# EAGLE design kaya-insolev1 (EAGLE 9.1.0)
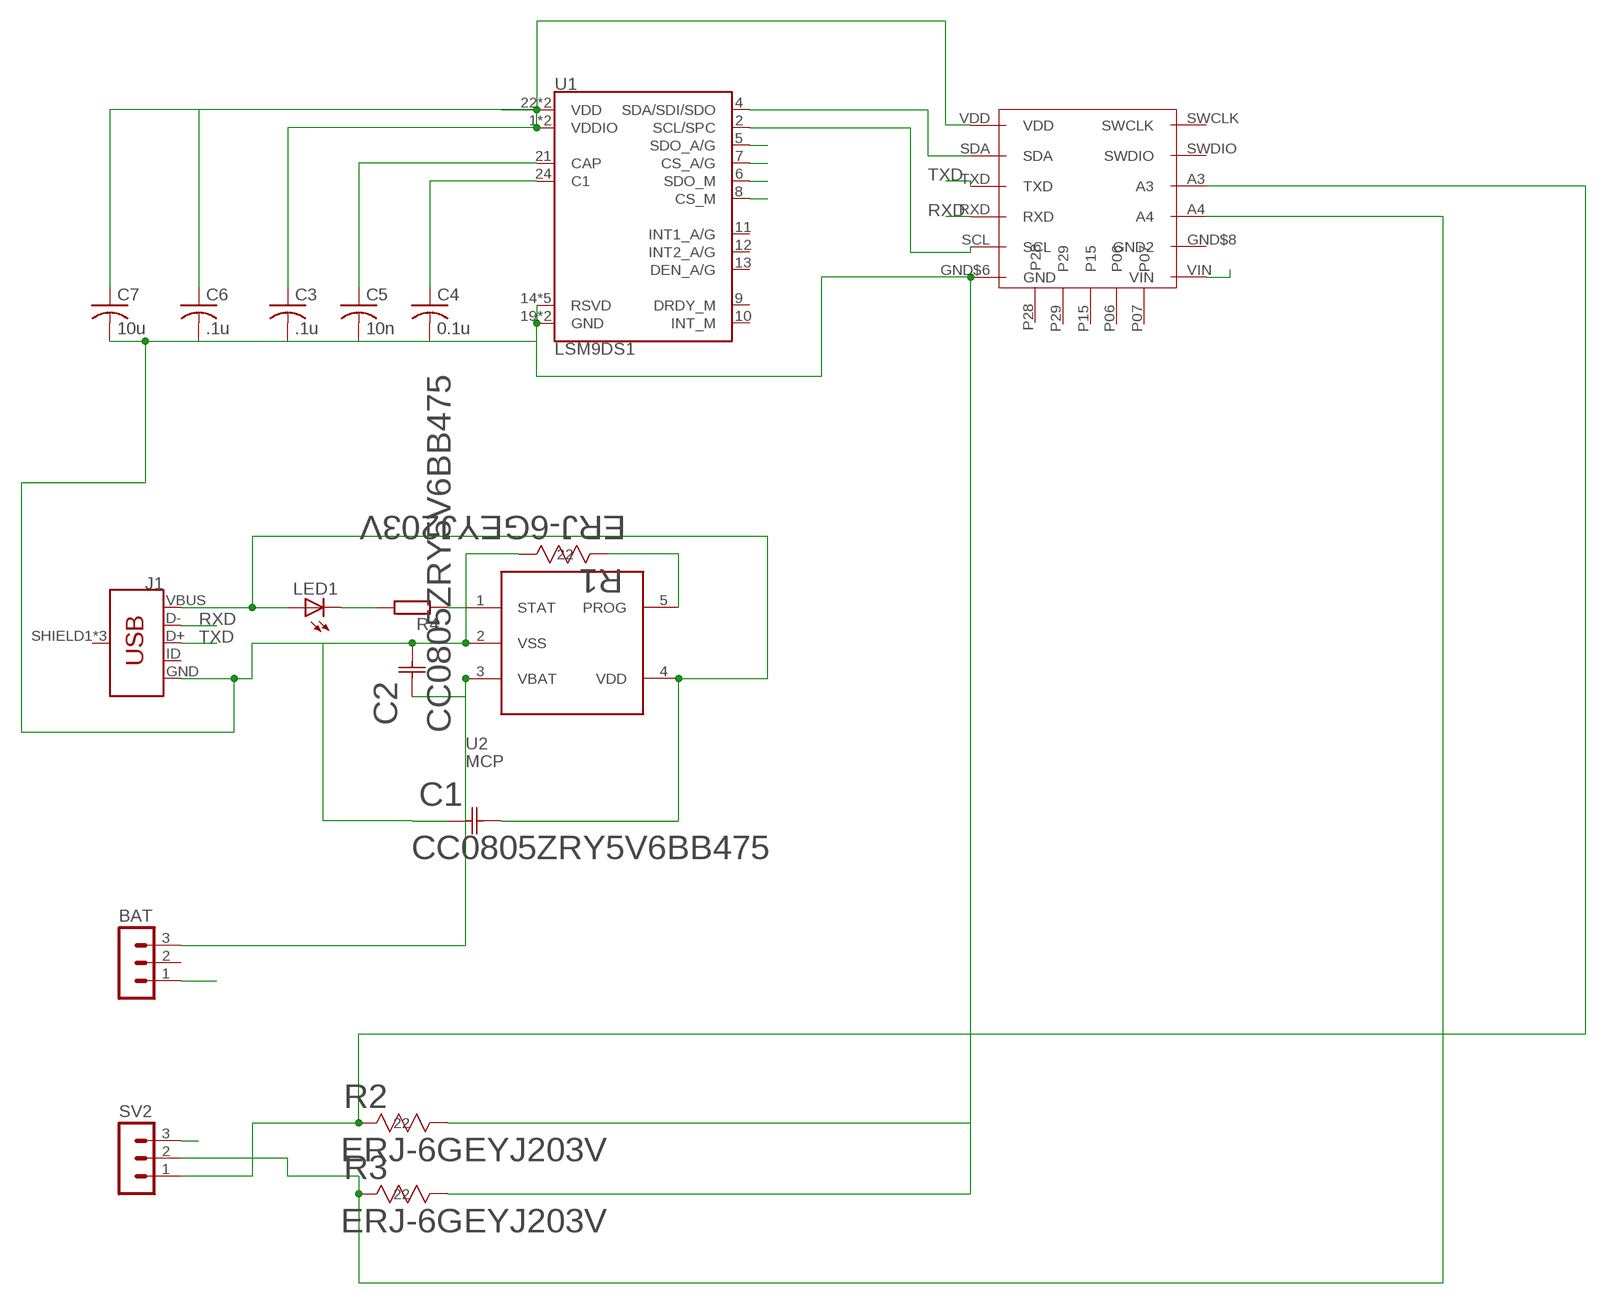
[diagram p0: schematic, sheet 1]

## Parts
BAT  MA03-1  [MA03-1]
C1  CC0805ZRY5V6BB475  [YAG_CC0805]
C2  CC0805ZRY5V6BB475  [YAG_CC0805]
C3  .1u  C-USC0603  [C0603]
C4  0.1u  C-USC0603  [C0603]
C5  10n  C-USC0603  [C0603]
C6  .1u  C-USC0603  [C0603]
C7  10u  C-USC0603  [C0603]
J1  USB_MICRO-B_FEMALE-SMT  [USB-B-MICRO-SMD]
LED1  LEDCHIPLED_0603  [CHIPLED_0603]
R1  ERJ-6GEYJ203V  [RC0805N]
R2  ERJ-6GEYJ203V  [RC0805N]
R3  ERJ-6GEYJ203V  [RC0805N]
R4  R-EU_R0603  [R0603]
SV2  MA03-1  [MA03-1]
U1  LSM9DS1  [LGA-24-3.5X3]
U2  MCP  MCP73832T-2ACI/OT  [SOT23-5]
U$1  BLE-NANO  [BLE-NANO-PKG]

## Nets
GND [GND]: C1.1 C2.2 C3.2 C4.2 C5.2 C6.2 C7.2 J1.GND R1.1 R2.1 R3.1 U1.14(RSVD) U1.15(RSVD) U1.16(RSVD) U1.17(RSVD) U1.18(RSVD) U1.19(GND) U1.20(GND) U2.2(VSS) U$1.GND$6(GND)
N$3: U1.4(SDA/SDI/SDO) U$1.SDA
N$4: U1.2(SCL/SPC) U$1.SCL
N$5: C4.1 U1.24(C1)
N$6: C5.1 U1.21(CAP)
N$8: LED1.C R4.2
N$9: R4.1 U2.1(STAT)
N$12: BAT.3 C2.1 U2.3(VBAT)
N$13: R2.2 SV2.1 U$1.A3
N$14: R3.2 SV2.2 U$1.A4
N$16: R1.2 U2.5(PROG)
RXD: J1.D- U$1.RXD
TXD: J1.D+ U$1.TXD
VBUS: C1.2 J1.VBUS LED1.A U2.4(VDD)
VDD: C3.1 C6.1 C7.1 SV2.3 U1.1(VDDIO) U1.3(VDDIO) U1.5(SDO_A/G) U1.6(SDO_M) U1.7(CS_A/G) U1.8(CS_M) U1.22(VDD) U1.23(VDD) U$1.VDD
VIN: BAT.1 U$1.VIN
Unconnected: BAT.2 J1.ID J1.SHIELD1(SHIELD) J1.SHIELD2(SHIELD) J1.SHIELD3(SHIELD) U1.9(DRDY_M) U1.10(INT_M) U1.11(INT1_A/G) U1.12(INT2_A/G) U1.13(DEN_A/G) U$1.GND$8(GND2) U$1.P06 U$1.P07 U$1.P15 U$1.P28 U$1.P29 U$1.SWCLK U$1.SWDIO

## Library data of the parts
BAT SV2 = con-lstb:MA03-1: PIN HEADER; OC_FARNELL: unknown; OC_NEWARK: unknown
C1 C2 = Yageo 4.7uF Cap:CC0805ZRY5V6BB475; MANUFACTURER_PART_NUMBER: CC0805ZRY5V6BB475; VENDOR: Yageo
C3-C7 = rcl:C-US: CAPACITOR, American symbol; SPICEPREFIX: C
J1 = SparkFun-Connectors:USB_MICRO-B: USB Type Micro-B Connector Male/female and PTH/SMT variants SparkFun Products: SparkFun microB USB Breakout <https://www.sparkfun.com/products/12035> SparkFun USB microB Plug Breakout <https://www.sparkfun.com/products/10031> SparkFun ESP8266 Thing <https://www.sparkfun.com/products/13231>; PROD_ID: CONN-11752
LED1 = led:LED: LED OSRAM: - CHIPLED LG R971, LG N971, LY N971, LG Q971, LY Q971, LO R971, LY R971 LH N974, LH R974 LS Q976, LO Q976, LY Q976 LO Q996 - Hyper CHIPLED LW Q18S LB Q993, LB Q99A, LB R99A - SideLED LS A670, LO A670, LY A670, LG A670, LP A670 LB A673, LV A673, LT A673, LW A673 LH A674 LY A675 LS A676, LA A676, LO A676, LY A676, LW A676 LS A679, LY A679, LG A679 - Hyper Micro SIDELED® LS Y876, LA Y876, LO Y876, LY Y876 LT Y87S - SmartLED LW L88C, LW L88S LB L89C, LB L89S, LG L890 LS L89K, LO L89K, LY L89K LS L896, LA L896, LO L896, LY L896 - TOPLED LS T670, LO T670, LY T670, LG T670, LP T670 LSG T670, LSP T670, LSY T670, LOP T670, LYG T670 LG T671, LOG T671, LSG T671 LB T673, LV T673, LT T673, LW T673 LH T674 LS T676, LA T676, LO T676, LY T676, LB T676, LH T676, LSB T676, LW T676 LB T67C, LV T67C, LT T67C, LS T67K, LO T67K, LY T67K, LW E67C LS E67B, LA E67B, LO E67B, LY E67B, LB E67C, LV E67C, LT E67C LW T67C LS T679, LY T679, LG T679 LS T770, LO T770, LY T770, LG T770, LP T770 LB T773, LV T773, LT T773, LW T773 LH T774 LS E675, LA E675, LY E675, LS T675 LS T776, LA T776, LO T776, LY T776, LB T776 LHGB T686 LT T68C, LB T68C - Hyper Mini TOPLED® LB M676 - Mini TOPLED Santana® LG M470 LS M47K, LO M47K, LY M47K Source: http://www.osram.convergy.de LUXEON: - LUMILED® LXK2-PW12-R00, LXK2-PW12-S00, LXK2-PW14-U00, LXK2-PW14-V00 LXK2-PM12-R00, LXK2-PM12-S00, LXK2-PM14-U00 LXK2-PE12-Q00, LXK2-PE12-R00, LXK2-PE12-S00, LXK2-PE14-T00, LXK2-PE14-U00 LXK2-PB12-K00, LXK2-PB12-L00, LXK2-PB12-M00, LXK2-PB14-N00, LXK2-PB14-P00, LXK2-PB14-Q00 LXK2-PR12-L00, LXK2-PR12-M00, LXK2-PR14-Q00, LXK2-PR14-R00 LXK2-PD12-Q00, LXK2-PD12-R00, LXK2-PD12-S00 LXK2-PH12-R00, LXK2-PH12-S00 LXK2-PL12-P00, LXK2-PL12-Q00, LXK2-PL12-R00 Source: www.luxeon.com KINGBRIGHT: KA-3528ASYC Source: www.kingbright.com
R1-R3 = Panasonic 20K Res:ERJ-6GEYJ203V; MANUFACTURER_PART_NUMBER: ERJ6GEYJ203V; VENDOR: Panasonic
R4 = rcl:R-EU_: RESISTOR, European symbol; SPICEPREFIX: R
U1 = SparkFun-Sensors:LSM9DS1: ST Microelectronics LSM9DS1 9DOF IMU - Accelerometer, Gyroscope & Magnetometer The LSM9DS1 is a versatile, motion-sensing system-in-a-chip. It houses a 3-axis accelerometer, 3-axis gyroscope, and 3-axis magnetometer – nine degrees of freedom (9DOF) in a single IC! The LSM9DS1 is equipped with a digital interface, but even that is flexible: it supports both I2C and SPI, so you’ll be hard-pressed to find a microcontroller it doesn’t work with. Datasheet <https://cdn.sparkfun.com/assets/learn_tutorials/3/7/3/LSM9DS1_Datasheet.pdf> SparkFun Products SparkFun 9 Degrees of Freedom IMU Breakout - LSM9DS1 <https://www.sparkfun.com/products/13284> (SEN-13284) SparkFun Photon IMU Shield <https://www.sparkfun.com/products/13629> (DEV-13629); PROD_ID: IC-12536
U2 = MCP73832T-2ACI_OT:MCP73832T-2ACI/OT: http://octopart.com/mcp73832t-2aci%2Fot-microchip-664172; AVAILABILITY: Unavailable; MF: Microchip; MP: MCP73832T-2ACI-OT; PACKAGE: SOT-23-5 Microchip; PRICE: None
U$1 = BLE-NANO:BLE-NANO

## Net classes
0 signal: width 0.127 mm
1 VDD: width 0.254 mm
2 GND: width 0.254 mm

## Board
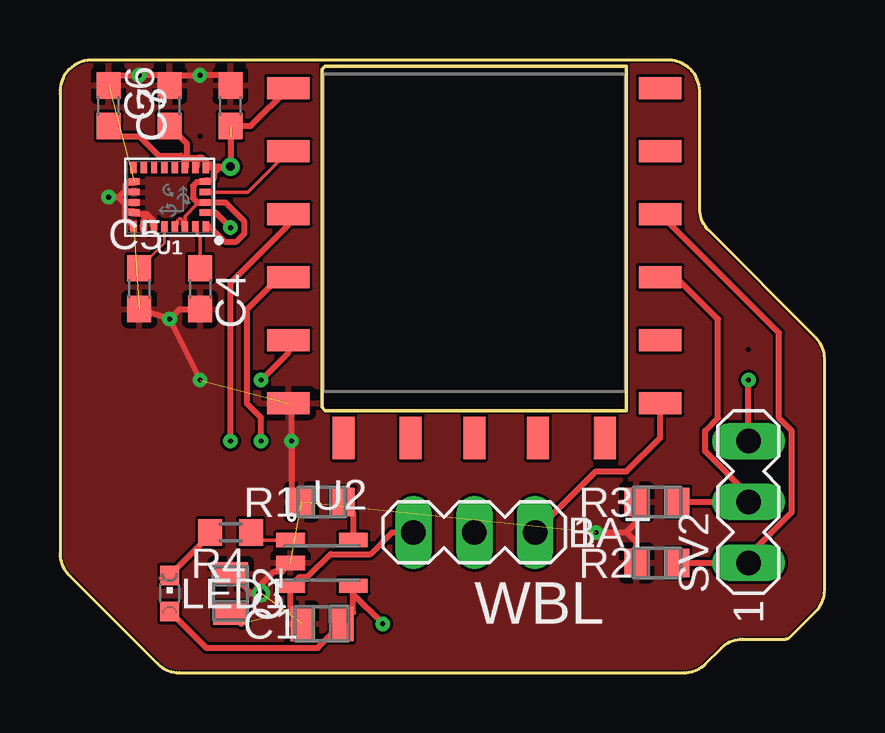
[diagram p1: board, top side]
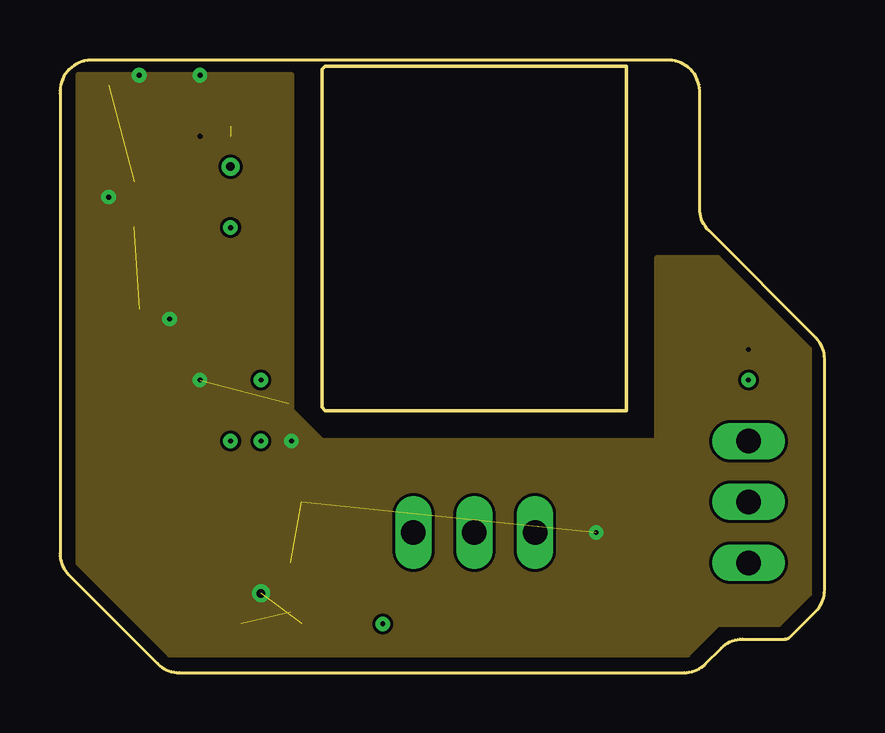
[diagram p2: board, inner layer GND]
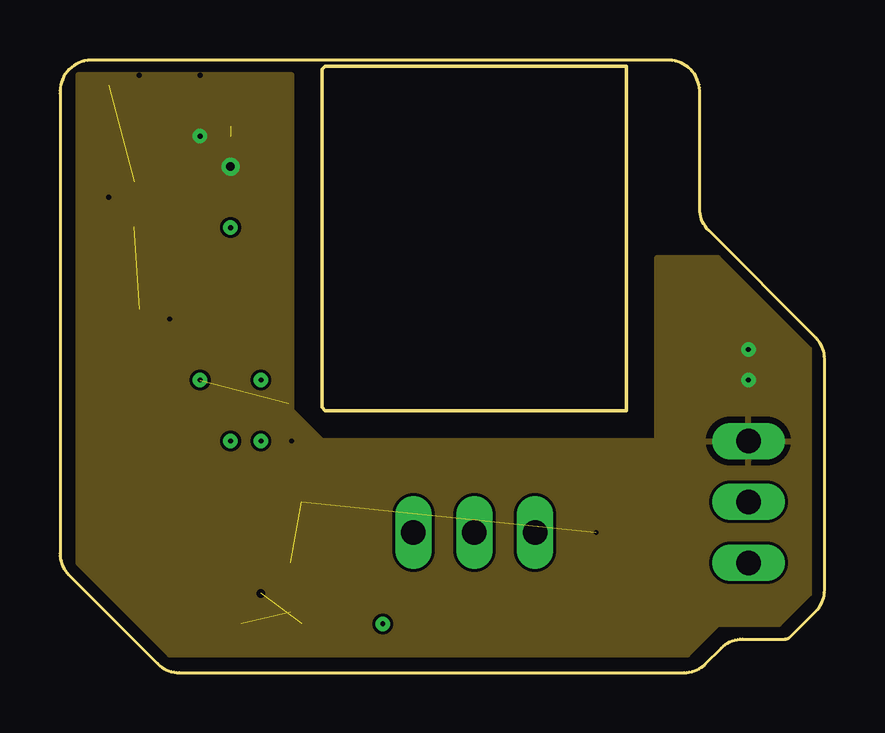
[diagram p3: board, inner layer VDD]
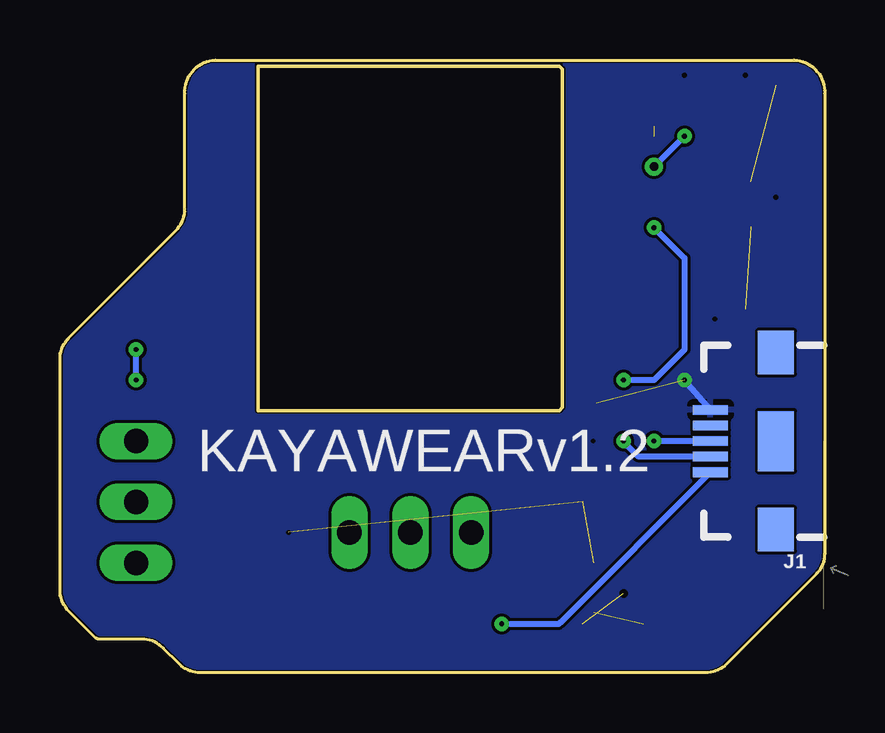
[diagram p4: board, bottom side, seen from below]

Size 31.88 x 25.53 mm. Coordinates in mm from the lower left corner, seen from the top.
Outline: 0,24.13 0,4.97 arc45 0.37,4.07 4.07,0.37 arc45 4.97,0 26.02,0 arc45 26.92,0.37 27.57,1.03 arc-45 28.47,1.4 30.23,1.4 arc45 30.44,1.49 31.51,2.55 arc45 31.88,3.45 31.88,13.06 arc45 31.51,13.96 27.04,18.42 arc-45 26.67,19.32 26.67,24.13 arc90 25.4,25.53 1.27,25.53 arc90 0,24.13
Outline: 10.92,25.02 10.92,11.05 11.05,10.92 23.62,10.92 23.62,25.02 23.62,25.27 11.05,25.27 10.92,25.15 10.92,25.02
Copper layers ((1*2)+(15*16)): SIGNAL 0.035mm / dielectric 0.2mm / GND 0.035mm / dielectric 0.15mm / VDD 0.035mm / dielectric 0.2mm / Bottom 0.035mm
Design rules "default *": minimum track width 5mil, minimum drill 0.2mm, track to track 5mil, track to pad 5mil, pad to pad 5mil, via to via 5mil, smd to smd 5mil, copper to edge 2mil, drill to drill 8mil, minimum pad ring 10mil, minimum via ring 8mil, stop-mask expansion 4mil, vias tented up to drill 0mil, thermal gap 10mil
tRestrict: area 10.9,11 to 23.7,25.3
bRestrict: area 10.9,10.9 to 23.7,25.3

### Footprints (pad centres in the part's own frame; a part is rotated, then mirrored left to right if it is on the bottom)
MA03-1 = drill 1.016 long: 1 -2.54,0; 2 0,0; 3 2.54,0
YAG_CC0805 = smd 0.965 x 1.448: 1 -0.826,0; 2 0.826,0
C0603 = smd 1.1 x 1: 1 -0.85,0; 2 0.85,0
USB-B-MICRO-SMD = smd 1.45 x 0.4: D+ 2.725,0; D- 2.725,0.65; GND 2.725,-1.3; ID 2.725,-0.65; VBUS 2.725,1.3 | smd 1.5 x 1.8: SHIELD1 0,3.685; SHIELD2 0,-3.685 | smd 1.5 x 2.5: SHIELD3 0,0
CHIPLED_0603 = smd 0.8 x 0.8: A 0,-0.75; C 0,0.75
RC0805N = smd 1.006 x 1.2: 1 -0.853,0; 2 0.853,0
R0603 = smd 1 x 1.1: 1 -0.85,0; 2 0.85,0
LGA-24-3.5X3 = smd 0.27 x 0.45: 1 -1.505,1.225; 6 -1.505,-1.225; 7 -1.075,-1.225; 8 -0.645,-1.225; 9 -0.215,-1.225; 10 0.215,-1.225; 11 0.645,-1.225; 12 1.075,-1.225; 13 1.505,-1.225; 18 1.505,1.225; 19 1.075,1.225; 20 0.645,1.225; 21 0.215,1.225; 22 -0.215,1.225; 23 -0.645,1.225; 24 -1.075,1.225 | smd 0.45 x 0.27: 2 -1.475,0.645; 3 -1.475,0.215; 4 -1.475,-0.215; 5 -1.475,-0.645; 14 1.475,-0.645; 15 1.475,-0.215; 16 1.475,0.215; 17 1.475,0.645
SOT23-5 = smd 1.2 x 0.6: 1 -1.306,0.95; 2 -1.306,0; 3 -1.306,-0.95; 4 1.306,-0.95; 5 1.306,0.95
BLE-NANO-PKG = smd 1.778 x 0.914: A3 7.75,4.375; A4 7.75,1.75; GND$6 -7.75,-3.5; GND$8 7.75,-0.875; RXD -7.75,1.75; SCL -7.75,-0.875; SDA -7.75,7; SWCLK 7.75,9.625; SWDIO 7.75,7; TXD -7.75,4.375; VDD -7.75,9.625; VIN 7.75,-3.5 | smd 0.914 x 1.778: P06 2.65,-4.95; P07 5.45,-4.95; P15 0,-4.95; P28 -5.45,-4.95; P29 -2.65,-4.95

### Placement (x,y rotation side)
BAT  17.27,5.84 180 top
C1  10.92,2.03 0 top
C2  7.11,3.3 90 top
C3  2.03,23.62 90 top
C4  5.84,16 270 top
C5  3.3,16 270 top
C6  4.57,23.62 90 top
C7  7.11,23.62 90 top
J1  2.03,9.65 180 bottom
LED1  4.57,3.3 0 top
R1  10.92,7.11 0 top
R2  24.89,4.57 0 top
R3  24.89,7.11 0 top
R4  7.11,5.84 180 top
SV2  28.7,7.11 90 top
U1  4.57,19.81 180 top
U2  10.92,4.57 0 top
U$1  17.27,14.73 0 top

### Tracks (layer width: path | path; a pad name or v marks a point on that pad's centre or on a via)
GND  (via drill 0.2, 0.2 layers 1-2, 0.35 layers 1-2)  (6 unrouted)
  SIGNAL 0.254: v4.57,14.73 C5.2 | v4.57,14.73 4.99,15.15 C4.2 | C3.2 2.45,24.89 v3.3,24.89 4.15,24.89 C6.2 4.99,24.89 v5.84,24.89 6.69,24.89 C7.2 | 2.45,19.81 v2.03,19.81 | U1.14 3.03,20.39 2.81,20.39 2.72,20.3 2.72,20.08 2.45,19.81 | U1.15 2.67,20.03 2.45,19.81 | U1.16 2.67,19.6 2.45,19.81 | 2.72,19.32 2.81,19.23 3.03,19.23 U1.17 3.16,19.1 | 2.45,19.81 2.72,19.54 2.72,19.32 | U1.18 2.85,18.8 2.81,18.8 2.72,18.89 2.72,19.32 | 3.44,19.1 3.52,19.02 3.52,18.89 3.5,18.86 U1.19 | 3.44,19.1 3.16,19.1 | U1.20 3.86,18.65 3.86,18.88 3.64,19.1 3.44,19.1 | 3.44,19.1 3.16,19.1 | v4.57,14.73 v5.84,12.19 | U$1.GND$6 9.65,11.1 v9.65,9.65 9.65,7.53 R1.1 | U2.2 9.25,4.2 8.9,4.2 8.38,3.68 v8.38,3.3 7.94,3.3 C2.2 | v22.35,5.84 23.62,5.84 | 23.62,5.84 24.04,6.26 R3.1 | R2.1 24.04,5.43 23.62,5.84
  Bottom 0.254: J1.GND v5.84,12.19
  pour GND: 0.76,9.65 0.76,4.57 4.57,0.76 26.16,0.76 27.43,2.03 29.97,2.03 31.24,3.3 31.24,4.57 31.24,13.46 27.43,17.27 24.89,17.27 24.89,9.65 10.92,9.65 9.65,10.92 9.65,13.46 9.65,24.89 0.76,24.89
  pour SIGNAL: -0.63,25.91 -0.63,-0.76 -0.76,-0.89 32.64,-0.89 32.89,-0.63 32.89,26.04 32.77,26.16 -0.38,26.16 -0.51,26.04
  pour Bottom: -1.02,26.04 -1.02,-1.27 -0.89,-1.4 33.02,-1.4 33.4,-1.02 33.4,26.67 -0.76,26.67 -1.02,26.42
N$3
  SIGNAL 0.152: U1.4 7.82,20.03 U$1.SDA
N$4  (via drill 0.2)
  SIGNAL 0.254: U1.2 6.49,19.17 v7.11,18.54 | v8.38,12.19 9.52,13.33 U$1.SCL
  Bottom 0.254: v7.11,18.54 5.84,17.27 5.84,13.46 7.11,12.19 v8.38,12.19
N$5
  SIGNAL 0.152: C4.1 5.84,18.14 5.71,18.27 5.71,18.52 U1.24
N$6
  SIGNAL 0.127: C5.1 4.36,17.91 U1.21
N$8
  SIGNAL 0.254: LED1.C 6.26,5.74 R4.2
N$9
  SIGNAL 0.152: R4.1 8.28,5.52 U2.1
N$12  (1 unrouted)
  SIGNAL 0.254: C2.1 7.56,2.03 | 9.62,2.51 U2.3 9.99,3.99 10.33,3.99 11.28,4.94 12.94,4.94 13.84,5.84 BAT.3
N$13
  SIGNAL 0.254: R2.2 SV2.1 28.7,4.88 30.51,6.68 30.51,10.08 29.97,10.62 29.97,14.16 U$1.A3
N$14
  SIGNAL 0.254: R3.2 SV2.2 28.7,7.42 26.9,9.22 26.9,10.08 27.43,10.62 27.43,14.73 25.68,16.48 U$1.A4
N$16
  SIGNAL 0.254: R1.2 12.23,6.66 U2.5
RXD  (via drill 0.2)
  SIGNAL 0.254: v8.38,9.65 8.38,10.63 7.8,11.21 7.8,15.15 9.14,16.48 U$1.RXD
  Bottom 0.254: J1.D- 7.11,9 7.76,9 8.38,9.62 v8.38,9.65
TXD  (via drill 0.2)
  SIGNAL 0.254: v7.11,9.65 7.11,16.26 9.52,18.67 U$1.TXD
  Bottom 0.254: J1.D+ v7.11,9.65
VBUS  (via drill 0.2)
  SIGNAL 0.254: LED1.A 6.1,1.03 10.74,1.03 C1.2 12.23,2.51 U2.4 12.23,3.27 v13.46,2.03
  Bottom 0.254: J1.VBUS 11,2.11 | 11,2.11 11.08,2.03 | 11,2.11 11.08,2.03 | 11,2.11 11.08,2.03 | 11,2.11 | v13.46,2.03 11.08,2.03
VDD  (via drill 0.2, 0.2 layers 15-16, 0.35)  (1 unrouted)
  SIGNAL 0.152: U1.22 4.9,18.7 4.9,18.85 4.96,18.91 5.04,18.91 5.1,18.85 5.1,18.66 5.22,18.54 U1.23 5.22,19.02 5.73,19.53 5.98,19.53 U1.3 | 6.76,22.35 7.11,22.35 | U1.1 6.12,18.54
  SIGNAL 0.254: v7.11,21.08 7.07,21.04 | 7.07,21.04 U1.6 | 5.93,21.46 5.8,21.46 | 5.8,21.46 5.71,21.38 5.71,21.1 U1.7 | v7.11,21.08 6.31,21.08 5.93,21.46 | 5.28,21.38 5.37,21.46 5.8,21.46 | 5.8,21.46 5.93,21.46 | U1.8 5.28,21.1 5.28,21.38 | C3.1 2.45,22.35 3.3,22.35 4.11,21.54 5.04,21.54 5.2,21.38 5.28,21.38 | C6.1 5.28,22.06 5.28,21.38 | 7.07,21.04 6.63,21.04 6.42,20.83 6.42,20.61 6.34,20.52 6.11,20.52 U1.5 6.03,20.44 5.71,20.44 5.54,20.28 5.54,19.78 5.73,19.59 5.73,19.58 5.98,19.58 6,19.6 U1.3 6.06,19.58 6.9,19.58 7.7,18.78 7.7,18.3 7.35,17.96 6.87,17.96 6.24,18.59 U1.1 | 7.94,22.77 7.95,22.78 | 7.95,22.78 U$1.VDD | SV2.3 v28.7,12.19 | 7.95,22.78 7.94,22.77 | 7.94,22.77 C7.1 v7.11,21.08
  Bottom 0.254: v5.84,22.35 v7.11,21.08 | v28.7,12.19 v28.7,13.46
  pour VDD: 0.76,10.92 0.76,4.57 4.57,0.76 26.16,0.76 27.43,2.03 29.97,2.03 31.24,3.3 31.24,13.46 27.43,17.27 24.89,17.27 24.89,9.65 10.92,9.65 9.65,10.92 9.65,24.89 0.76,24.89
VIN
  SIGNAL 0.254: BAT.1 22.35,8.38 23.62,8.38 25.02,9.78 U$1.VIN

### Text on the board
tPlace: WBL
bPlace: KAYAWEARv1.2